# Altium schematic sheet FA18_DDI.SchDoc
size A3; SheetNumber: 1; SheetTotal: 1
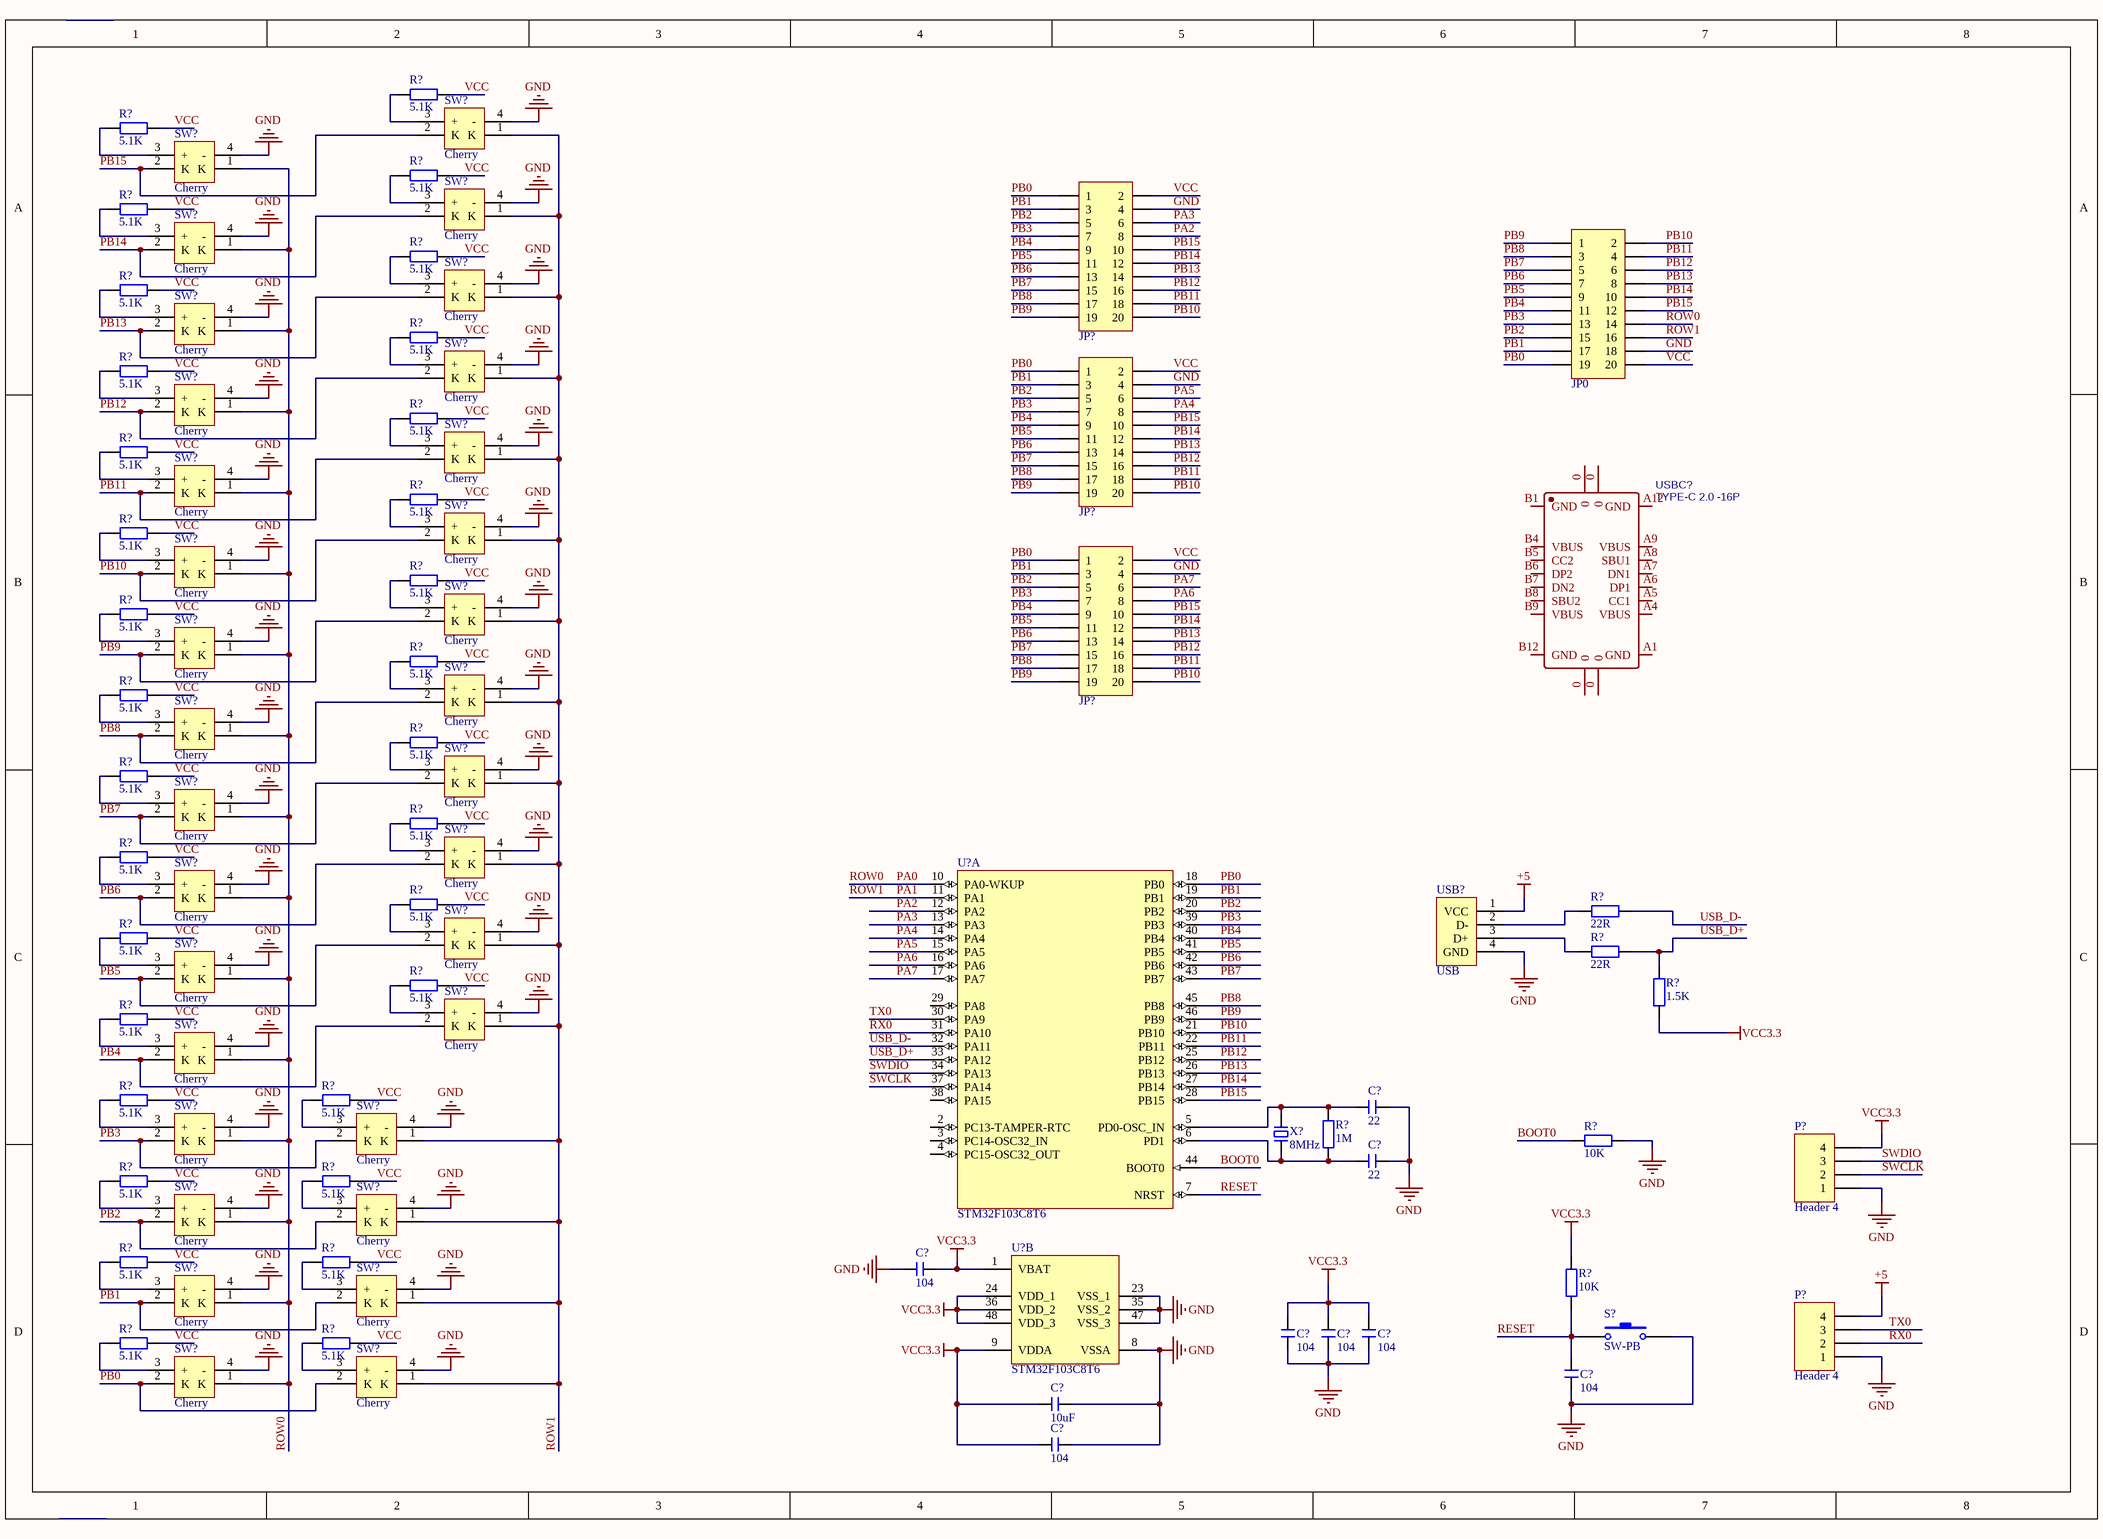
[diagram p0: FA18_DDI.SchDoc]

## Parts
(Parts that share a designator on the sheet are numbered #1, #2 ... from top to bottom, then left to right.)
C?#1  22  [C 0603_L]
C?#2  22  [C 0603_L]
C?#3  104  [C 0603_L]
C?#4  104  [C 0603_L]
C?#5  104  [C 0603_L]
C?#6  104  [C 0603_L]
C?#7  104  [C 0603_L]
C?#8  10uF  [C 0603_L]
C?#9  104  [C 0603_L]
JP0  Header 2X10  [PHB2.0-LI-2x10P]  (value not drawn)
JP?#1  Header 2X10  [PHB2.0-LI-2x10P]  (value not drawn)
JP?#2  Header 2X10  [PHB2.0-LI-2x10P]  (value not drawn)
JP?#3  Header 2X10  [PHB2.0-LI-2x10P]  (value not drawn)
P?#1  Header 4  [HDR1X4]
P?#2  Header 4  [HDR1X4]
R?#1  5.1K  [R 0603_L]
R?#2  5.1K  [R 0603_L]
R?#3  5.1K  [R 0603_L]
R?#4  5.1K  [R 0603_L]
R?#5  5.1K  [R 0603_L]
R?#6  5.1K  [R 0603_L]
R?#7  5.1K  [R 0603_L]
R?#8  5.1K  [R 0603_L]
R?#9  5.1K  [R 0603_L]
R?#10  5.1K  [R 0603_L]
R?#11  5.1K  [R 0603_L]
R?#12  5.1K  [R 0603_L]
R?#13  5.1K  [R 0603_L]
R?#14  5.1K  [R 0603_L]
R?#15  5.1K  [R 0603_L]
R?#16  5.1K  [R 0603_L]
R?#17  5.1K  [R 0603_L]
R?#18  5.1K  [R 0603_L]
R?#19  5.1K  [R 0603_L]
R?#20  5.1K  [R 0603_L]
R?#21  5.1K  [R 0603_L]
R?#22  22R  [R 0603_L]
R?#23  5.1K  [R 0603_L]
R?#24  22R  [R 0603_L]
R?#25  5.1K  [R 0603_L]
R?#26  5.1K  [R 0603_L]
R?#27  1.5K  [R 0603_L]
R?#28  5.1K  [R 0603_L]
R?#29  5.1K  [R 0603_L]
R?#30  10K  [R 0603_L]
R?#31  1M  [R 0603_L]
R?#32  5.1K  [R 0603_L]
R?#33  5.1K  [R 0603_L]
R?#34  5.1K  [R 0603_L]
R?#35  5.1K  [R 0603_L]
R?#36  10K  [R 0603_L]
R?#37  5.1K  [R 0603_L]
R?#38  5.1K  [R 0603_L]
S?  SW-PB  [SW_PB2_A1]
SW?#1  Cherry  [LSW DIP-CHERRY]
SW?#2  Cherry  [LSW DIP-CHERRY]
SW?#3  Cherry  [LSW DIP-CHERRY]
SW?#4  Cherry  [LSW DIP-CHERRY]
SW?#5  Cherry  [LSW DIP-CHERRY]
SW?#6  Cherry  [LSW DIP-CHERRY]
SW?#7  Cherry  [LSW DIP-CHERRY]
SW?#8  Cherry  [LSW DIP-CHERRY]
SW?#9  Cherry  [LSW DIP-CHERRY]
SW?#10  Cherry  [LSW DIP-CHERRY]
SW?#11  Cherry  [LSW DIP-CHERRY]
SW?#12  Cherry  [LSW DIP-CHERRY]
SW?#13  Cherry  [LSW DIP-CHERRY]
SW?#14  Cherry  [LSW DIP-CHERRY]
SW?#15  Cherry  [LSW DIP-CHERRY]
SW?#16  Cherry  [LSW DIP-CHERRY]
SW?#17  Cherry  [LSW DIP-CHERRY]
SW?#18  Cherry  [LSW DIP-CHERRY]
SW?#19  Cherry  [LSW DIP-CHERRY]
SW?#20  Cherry  [LSW DIP-CHERRY]
SW?#21  Cherry  [LSW DIP-CHERRY]
SW?#22  Cherry  [LSW DIP-CHERRY]
SW?#23  Cherry  [LSW DIP-CHERRY]
SW?#24  Cherry  [LSW DIP-CHERRY]
SW?#25  Cherry  [LSW DIP-CHERRY]
SW?#26  Cherry  [LSW DIP-CHERRY]
SW?#27  Cherry  [LSW DIP-CHERRY]
SW?#28  Cherry  [LSW DIP-CHERRY]
SW?#29  Cherry  [LSW DIP-CHERRY]
SW?#30  Cherry  [LSW DIP-CHERRY]
SW?#31  Cherry  [LSW DIP-CHERRY]
SW?#32  Cherry  [LSW DIP-CHERRY]
U?#1  STM32F103C8T6  [LQFP48_N]  (part A of 2)
U?#2  STM32F103C8T6  [LQFP48_N]  (part B of 2)
USB?  USB  [USB-B/S_A]
USBC?  TYPE-C 2.0 -16P  [USB-C-SMD_TYPE-C-USB-5]
X?  8MHz  [OSC HC-49S]

## Nets
+5: P?#2.4 USB?.1(VCC)
GND: C?#1.2 C?#2.2 C?#3.1 C?#4.1 C?#5.1 C?#6.1 C?#7.2 C?#8.2 C?#9.2 JP0.18 JP?#1.4 JP?#2.4 JP?#3.4 P?#1.1 P?#2.1 R?#30.2 S?.2 SW?#1.4(-) SW?#2.4(-) SW?#3.4(-) SW?#4.4(-) SW?#5.4(-) SW?#6.4(-) SW?#7.4(-) SW?#8.4(-) SW?#9.4(-) SW?#10.4(-) SW?#11.4(-) SW?#12.4(-) SW?#13.4(-) SW?#14.4(-) SW?#15.4(-) SW?#16.4(-) SW?#17.4(-) SW?#18.4(-) SW?#19.4(-) SW?#20.4(-) SW?#21.4(-) SW?#22.4(-) SW?#23.4(-) SW?#24.4(-) SW?#25.4(-) SW?#26.4(-) SW?#27.4(-) SW?#28.4(-) SW?#29.4(-) SW?#30.4(-) SW?#31.4(-) SW?#32.4(-) U?#2.8(VSSA) U?#2.23(VSS_1) U?#2.35(VSS_2) U?#2.47(VSS_3) USB?.4(GND)
VCC3.3: C?#3.2 C?#4.2 C?#5.2 C?#6.2 C?#8.1 C?#9.1 P?#1.4 R?#27.1 R?#36.2 U?#2.1(VBAT) U?#2.9(VDDA) U?#2.24(VDD_1) U?#2.36(VDD_2) U?#2.48(VDD_3)
BOOT0: R?#30.1 U?#1.44(BOOT0)
PA0: JP0.14 SW?#2.1(K) SW?#4.1(K) SW?#6.1(K) SW?#8.1(K) SW?#10.1(K) SW?#12.1(K) SW?#14.1(K) SW?#16.1(K) SW?#18.1(K) SW?#20.1(K) SW?#22.1(K) SW?#24.1(K) SW?#25.1(K) SW?#27.1(K) SW?#29.1(K) SW?#31.1(K) U?#1.10(PA0-WKUP)  [also labelled ROW0]
PA1: JP0.16 SW?#1.1(K) SW?#3.1(K) SW?#5.1(K) SW?#7.1(K) SW?#9.1(K) SW?#11.1(K) SW?#13.1(K) SW?#15.1(K) SW?#17.1(K) SW?#19.1(K) SW?#21.1(K) SW?#23.1(K) SW?#26.1(K) SW?#28.1(K) SW?#30.1(K) SW?#32.1(K) U?#1.11(PA1)  [also labelled ROW1]
PA2: JP?#1.8 U?#1.12(PA2)
PA3: JP?#1.6 U?#1.13(PA3)
PA4: JP?#2.8 U?#1.14(PA4)
PA5: JP?#2.6 U?#1.15(PA5)
PA6: JP?#3.8 U?#1.16(PA6)
PA7: JP?#3.6 U?#1.17(PA7)
PB0: JP0.19 JP?#1.1 JP?#2.1 JP?#3.1 SW?#31.2(K) SW?#32.2(K) U?#1.18(PB0)
PB1: JP0.17 JP?#1.3 JP?#2.3 JP?#3.3 SW?#29.2(K) SW?#30.2(K) U?#1.19(PB1)
PB2: JP0.15 JP?#1.5 JP?#2.5 JP?#3.5 SW?#27.2(K) SW?#28.2(K) U?#1.20(PB2)
PB3: JP0.13 JP?#1.7 JP?#2.7 JP?#3.7 SW?#25.2(K) SW?#26.2(K) U?#1.39(PB3)
PB4: JP0.11 JP?#1.9 JP?#2.9 JP?#3.9 SW?#23.2(K) SW?#24.2(K) U?#1.40(PB4)
PB5: JP0.9 JP?#1.11 JP?#2.11 JP?#3.11 SW?#21.2(K) SW?#22.2(K) U?#1.41(PB5)
PB6: JP0.7 JP?#1.13 JP?#2.13 JP?#3.13 SW?#19.2(K) SW?#20.2(K) U?#1.42(PB6)
PB7: JP0.5 JP?#1.15 JP?#2.15 JP?#3.15 SW?#17.2(K) SW?#18.2(K) U?#1.43(PB7)
PB8: JP0.3 JP?#1.17 JP?#2.17 JP?#3.17 SW?#15.2(K) SW?#16.2(K) U?#1.45(PB8)
PB9: JP0.1 JP?#1.19 JP?#2.19 JP?#3.19 SW?#13.2(K) SW?#14.2(K) U?#1.46(PB9)
PB10: JP0.2 JP?#1.20 JP?#2.20 JP?#3.20 SW?#11.2(K) SW?#12.2(K) U?#1.21(PB10)
PB11: JP0.4 JP?#1.18 JP?#2.18 JP?#3.18 SW?#9.2(K) SW?#10.2(K) U?#1.22(PB11)
PB12: JP0.6 JP?#1.16 JP?#2.16 JP?#3.16 SW?#7.2(K) SW?#8.2(K) U?#1.25(PB12)
PB13: JP0.8 JP?#1.14 JP?#2.14 JP?#3.14 SW?#5.2(K) SW?#6.2(K) U?#1.26(PB13)
PB14: JP0.10 JP?#1.12 JP?#2.12 JP?#3.12 SW?#3.2(K) SW?#4.2(K) U?#1.27(PB14)
PB15: JP0.12 JP?#1.10 JP?#2.10 JP?#3.10 SW?#1.2(K) SW?#2.2(K) U?#1.28(PB15)
RESET: C?#7.1 R?#36.1 S?.1 U?#1.7(NRST)
RX0: P?#2.2 U?#1.31(PA10)
SWCLK: P?#1.2 U?#1.37(PA14)
SWDIO: P?#1.3 U?#1.34(PA13)
TX0: P?#2.3 U?#1.30(PA9)
USB_D+: R?#24.2 R?#27.2 U?#1.33(PA12)
USB_D-: R?#22.2 U?#1.32(PA11)
VCC: JP0.20 JP?#1.2 JP?#2.2 JP?#3.2 R?#1.2 R?#2.2 R?#3.2 R?#4.2 R?#5.2 R?#6.2 R?#7.2 R?#8.2 R?#9.2 R?#10.2 R?#11.2 R?#12.2 R?#13.2 R?#14.2 R?#15.2 R?#16.2 R?#17.2 R?#18.2 R?#19.2 R?#20.2 R?#21.2 R?#23.2 R?#25.2 R?#26.2 R?#28.2 R?#29.2 R?#32.2 R?#33.2 R?#34.2 R?#35.2 R?#37.2 R?#38.2
NetC?#1_1: C?#1.1 R?#31.2 U?#1.5(PD0-OSC_IN) X?.2
NetC?#2_1: C?#2.1 R?#31.1 U?#1.6(PD1) X?.1
NetR?#1_1: R?#1.1 SW?#1.3(+)
NetR?#2_1: R?#2.1 SW?#2.3(+)
NetR?#3_1: R?#3.1 SW?#3.3(+)
NetR?#4_1: R?#4.1 SW?#4.3(+)
NetR?#5_1: R?#5.1 SW?#5.3(+)
NetR?#6_1: R?#6.1 SW?#6.3(+)
NetR?#7_1: R?#7.1 SW?#7.3(+)
NetR?#8_1: R?#8.1 SW?#8.3(+)
NetR?#9_1: R?#9.1 SW?#9.3(+)
NetR?#10_1: R?#10.1 SW?#10.3(+)
NetR?#11_1: R?#11.1 SW?#11.3(+)
NetR?#12_1: R?#12.1 SW?#12.3(+)
NetR?#13_1: R?#13.1 SW?#13.3(+)
NetR?#14_1: R?#14.1 SW?#14.3(+)
NetR?#15_1: R?#15.1 SW?#15.3(+)
NetR?#16_1: R?#16.1 SW?#16.3(+)
NetR?#17_1: R?#17.1 SW?#17.3(+)
NetR?#18_1: R?#18.1 SW?#18.3(+)
NetR?#19_1: R?#19.1 SW?#19.3(+)
NetR?#20_1: R?#20.1 SW?#20.3(+)
NetR?#21_1: R?#21.1 SW?#21.3(+)
NetR?#22_1: R?#22.1 USB?.2(D-)
NetR?#23_1: R?#23.1 SW?#22.3(+)
NetR?#24_1: R?#24.1 USB?.3(D+)
NetR?#25_1: R?#25.1 SW?#23.3(+)
NetR?#26_1: R?#26.1 SW?#24.3(+)
NetR?#28_1: R?#28.1 SW?#25.3(+)
NetR?#29_1: R?#29.1 SW?#26.3(+)
NetR?#32_1: R?#32.1 SW?#27.3(+)
NetR?#33_1: R?#33.1 SW?#28.3(+)
NetR?#34_1: R?#34.1 SW?#29.3(+)
NetR?#35_1: R?#35.1 SW?#30.3(+)
NetR?#37_1: R?#37.1 SW?#31.3(+)
NetR?#38_1: R?#38.1 SW?#32.3(+)

Not connected (* = marked no-connect by the designer): U?#1 2(PC13-TAMPER-RTC) 3(PC14-OSC32_IN) 4(PC15-OSC32_OUT) 29(PA8) 38(PA15); USBC? 0 A1(GND) A4(VBUS) A5(CC1) A6(DP1) A7(DN1) A8(SBU1) A9(VBUS) A12(GND) B1(GND) B4(VBUS) B5(CC2) B6(DP2) B7(DN2) B8(SBU2) B9(VBUS) B12(GND)

## Library data of the parts
C?#1-C?#9 = C: 贴片电容; BOM名称: 无极性贴片电容; 淘宝ID: 封装库来自淘宝 ID：黄晶宝石; 联系售后，技术支持: https://shop463601444.taobao.com; 唯一出售店铺网址: https://shop463601444.taobao.com
JP0 JP?#1-JP?#3 = Header 10X2: 10*2P接插件; 封装库来自淘宝卖家 ID：黄晶宝石: 其他店铺购入均为盗版，不享受售后技术支持服务，请立即申请退款
P?#1 P?#2 = Header 4: Header, 4-Pin; LatestRevisionDate: 17-Jul-2002; LatestRevisionNote: Re-released for DXP Platform.; Publisher: Altium Limited
R?#1-R?#38 = R: 贴片电阻; 版权归属: 来自淘宝 ID：黄晶宝石; 封装库来自淘宝卖家 ID：黄晶宝石: 其他店铺购入均为盗版，不享受售后技术支持服务，请立即申请退款; BOM名称: 贴片电阻; 联系售后: https://shop463601444.taobao.com
S? = SW-PB: 微动开关; Published: 24-Mar-1999; LatestRevisionDate: 17-Jul-2002; LatestRevisionNote: Re-released for DXP Platform.; PackageReference: SPST-2; Publisher: Altium Limited
SW?#1-SW?#32 = LSW: 带灯机械按键开关; 版权归属: 封装库来自淘宝 ID：黄晶宝石; BOM名称: 带灯机械按键开关; 学习资源: https://shop463601444.taobao.com
U?#1 U?#2 = STM32F103C8T6: STM32 ARM-based 32-bit MCU Performance Line with 64 kB Flash, 20 kB Internal RAM, -40 to +85癈 Temperature, 48-Pin LQFP, Tray; DatasheetVersion: rev13.0, Apr-2011; PackageVersion: rev13, Apr-2011; PackageReference: LQFP48; PackageDescription: 48-Pin Low-Profile Quad Flat Pack, 7 x 7 mm Body, 0.5 mm Pitch (LQFP48); ComponentLink1Description: Manufacturer URL; ComponentLink1URL: http://www.st.com/; ComponentLink2Description: STM32F103 Datasheet; ComponentLink2URL: http://www.st.com/internet/com/TECHNICAL_RESOURCES/TECHNICAL_LITERATURE/DATASHEET/CD00161566.pdf; ComponentLink3Description: STM32 Family Web Page; ComponentLink3URL: www.st.com/stm32; 联系售后: https://shop463601444.taobao.com
USB? = USB-B/S: USB-B型母接口; 版权归属: 封装库来自淘宝 ID：黄晶宝石; BOM名称: USB-B型母接口; 学习资源: https://shop463601444.taobao.com
USBC? = USB2.0 Type-C 16Pin母座: USB2.0 Type-C 母座 16Pin; BOM_Manufacturer: LCSC; BOM_Supplier: LCSC; BOM_Manufacturer Part: -; spicePre: U; spiceSymbolName: TYPE-C 3.1 -16P_C168689
X? = XTAL-2P: 2脚无源脚晶振; 版权归属: 封装库来自淘宝卖家 ID：黄晶宝石; BOM名称: 2脚无源脚晶振; 学习资源: https://shop463601444.taobao.com